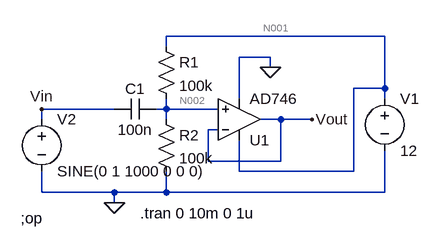
[diagram p0: schematic levelshifter.asc]
levelshifter.asc, the LTspice schematic file:
Version 4
SHEET 1 880 680
WIRE 416 -16 80 -16
WIRE 80 0 80 -16
WIRE 240 16 192 16
WIRE 240 32 240 16
WIRE 416 64 416 -16
WIRE 416 64 368 64
WIRE 192 80 192 16
WIRE 416 80 416 64
WIRE 0 96 -112 96
WIRE 80 96 80 80
WIRE 80 96 64 96
WIRE 160 96 80 96
WIRE -112 112 -112 96
WIRE 80 112 80 96
WIRE 256 112 224 112
WIRE 304 112 256 112
WIRE 160 128 144 128
WIRE 144 176 144 128
WIRE 256 176 256 112
WIRE 256 176 144 176
WIRE 192 192 192 144
WIRE 368 192 368 64
WIRE 368 192 192 192
WIRE -112 224 -112 192
WIRE 0 224 -112 224
WIRE 80 224 80 192
WIRE 80 224 0 224
WIRE 416 224 416 160
WIRE 416 224 80 224
WIRE 0 240 0 224
FLAG 0 240 0
FLAG 304 112 Vout
FLAG -112 96 Vin
FLAG 240 32 0
SYMBOL res 64 96 R0
SYMATTR InstName R2
SYMATTR Value 100k
SYMBOL voltage 416 64 R0
WINDOW 123 0 0 Left 0
WINDOW 39 0 0 Left 0
SYMATTR InstName V1
SYMATTR Value 12
SYMBOL cap 64 80 R90
WINDOW 0 0 32 VBottom 2
WINDOW 3 32 32 VTop 2
SYMATTR InstName C1
SYMATTR Value 100n
SYMBOL voltage -112 96 R0
WINDOW 123 0 0 Left 0
WINDOW 39 0 0 Left 0
SYMATTR InstName V2
SYMATTR Value SINE(0 1 1000 0 0 0)
SYMBOL Opamps\\AD746 192 176 M180
SYMATTR InstName U1
SYMBOL res 64 -16 R0
SYMATTR InstName R1
SYMATTR Value 100k
TEXT -144 264 Left 2 !;op
TEXT 40 256 Left 2 !.tran 0 10m 0 1u

The netlist it stands for:
* levelshifter.asc
R2 N002 0 100k
V1 N001 0 12
C1 N002 Vin 100n
V2 Vin 0 SINE(0 1 1000 0 0 0)
XU1 N002 Vout N001 0 Vout AD746  ; pins In+ In- V+ V- OUT
R1 N001 N002 100k
;op
.tran 0 10m 0 1u
.backanno
.end

* Results of the author's LTspice run, read from the files saved beside the schematic
* Operating Point, zero values left out:
*   V(n002) = 6 V
*   V(n001) = 12 V
*   V(vout) = 6 V
*   I(R1) = 60 µA
*   I(R2) = 60 µA
*   I(V1) = -3.886 mA
*   Ix(u1:1) = 110 pA
*   Ix(u1:2) = 110 pA
*   Ix(u1:3) = 3.826 mA
*   Ix(u1:4) = -3.826 mA
*   Ix(u1:5) = -110 pA
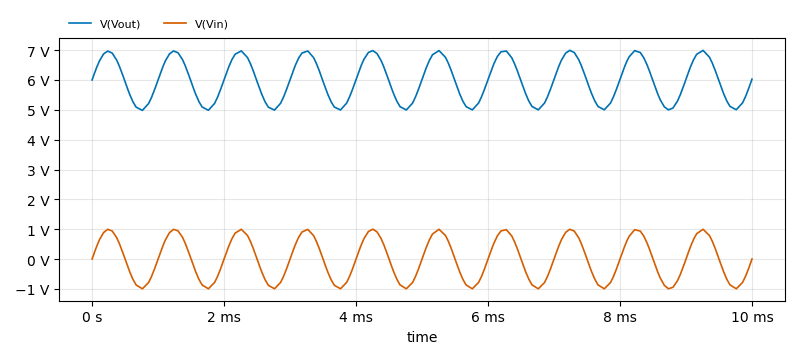
[diagram p1: Transient Analysis of levelshifter.asc, plotted from the saved traces]
* Transient Analysis, 1 run:
*   V(Vout): min 4.98 V, max 6.991 V, average 5.987 V, rms 6.028 V, last 6.027 V
*   V(Vin): min -996.6 mV, max 999.7 mV, average 1.036 mV, rms 697.5 mV, last 0 V